# EAGLE design Controller (EAGLE 9.1.1)
AUTOR: Alexander Miller; PROJECT: HeRo Mini

## Sheet 1 of 2
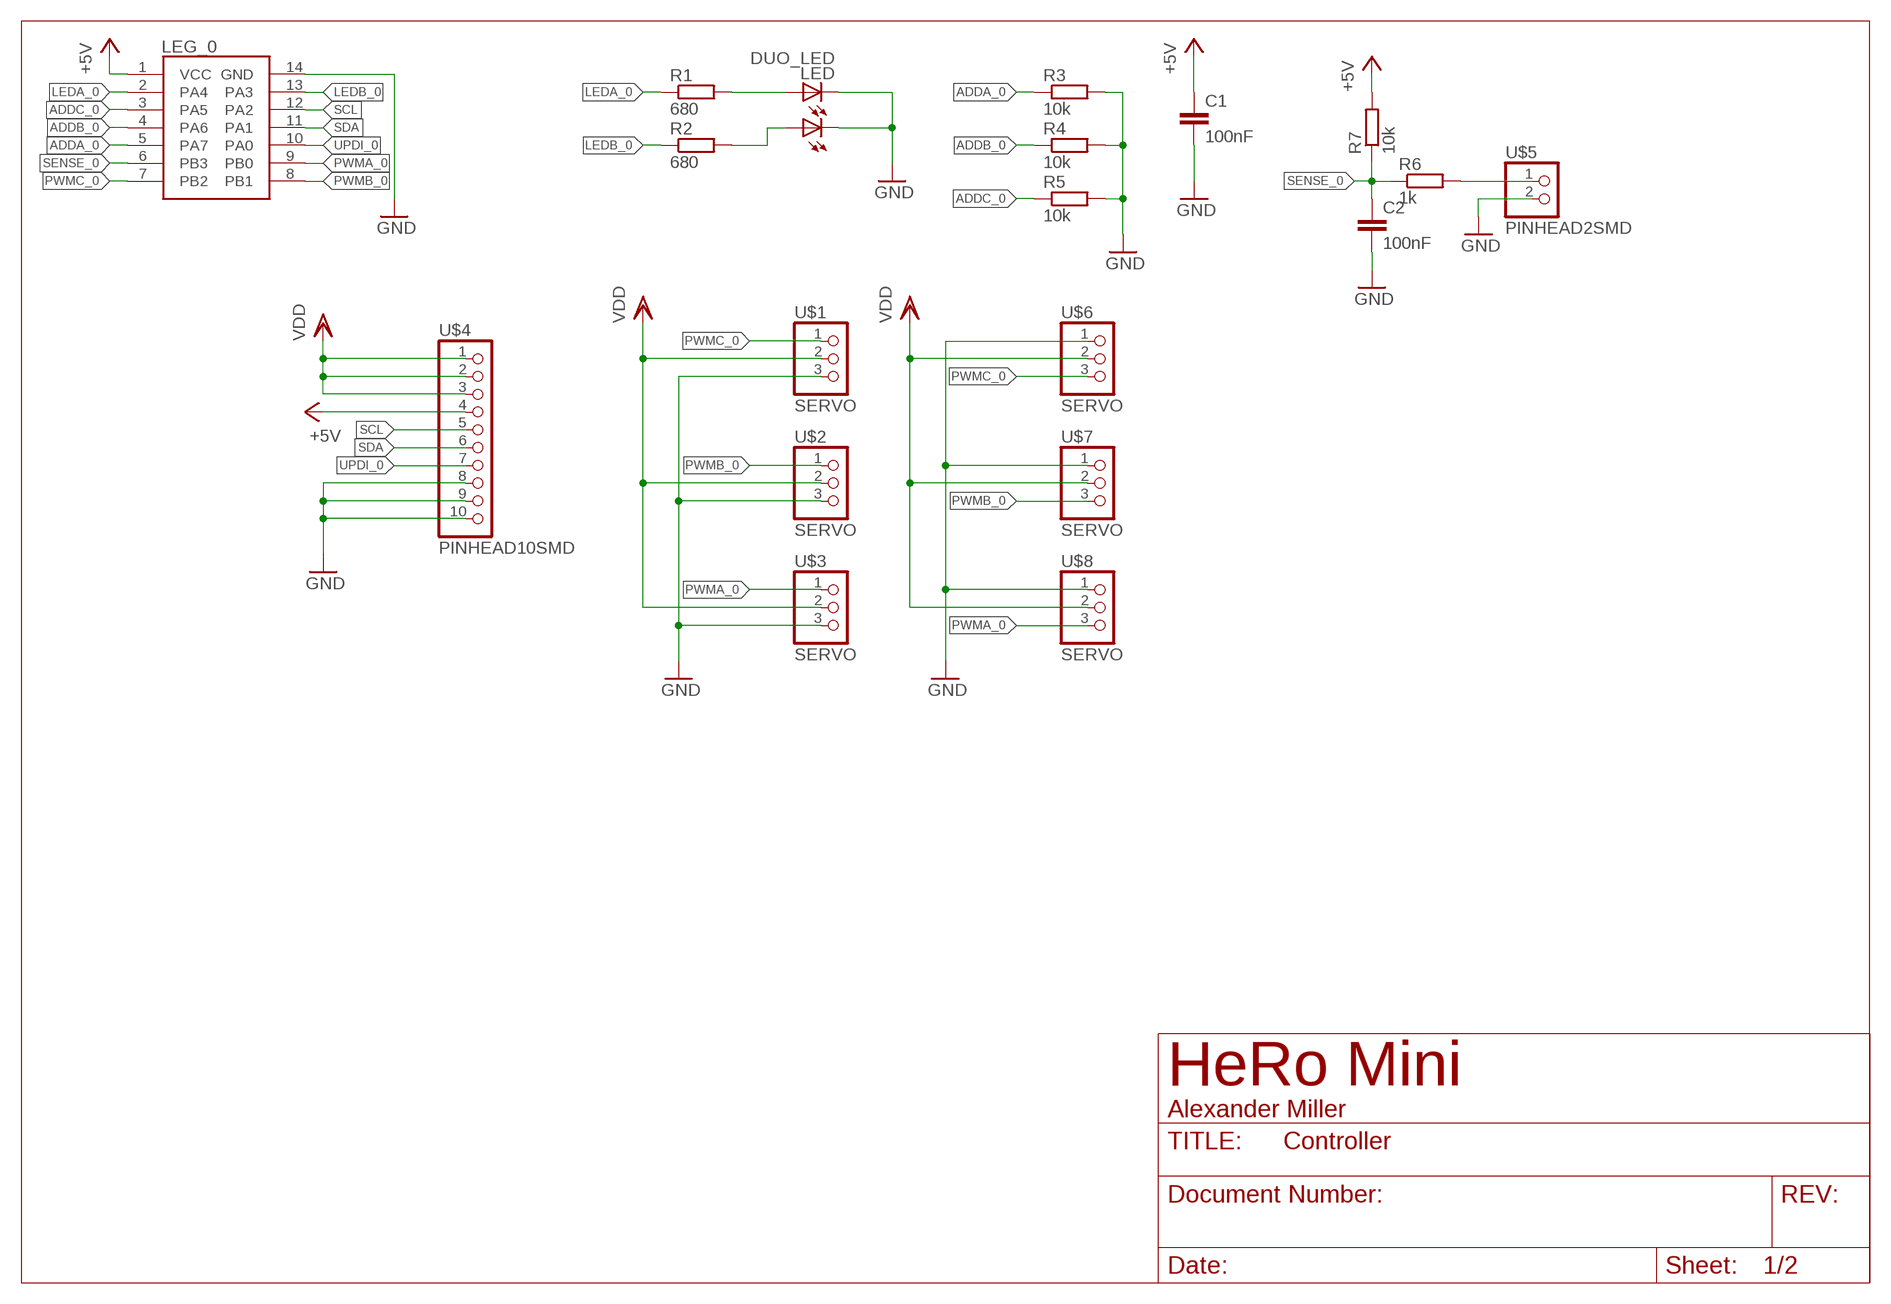
[diagram p0: schematic, sheet 1]

### Parts
C1  100nF  C-EUC0805  [C0805]
C2  100nF  C-EUC0805  [C0805]
LED  DUO_LED  [DUO_LED]
LEG_0  ATTINY16142  [SOIC127P600X175-14]
R1  680  R-EU_R0805  [R0805]
R2  680  R-EU_R0805  [R0805]
R3  10k  R-EU_R0805  [R0805]
R4  10k  R-EU_R0805  [R0805]
R5  10k  R-EU_R0805  [R0805]
R6  1k  R-EU_R0805  [R0805]
R7  10k  R-EU_R0805  [R0805]
U$1  SERVO  [SL12SMD058]
U$2  SERVO  [SL12SMD058]
U$3  SERVO  [SL12SMD058]
U$4  PINHEAD10SMD  [PINHD10SMD]
U$5  PINHEAD2SMD  [PINHD2SMD]
U$6  SERVO  [SL12SMD058]
U$7  SERVO  [SL12SMD058]
U$8  SERVO  [SL12SMD058]

### Nets
+5V: C1.1 LEG_0.1(VCC) R7.2 U$4.4
ADDA_0: LEG_0.5(PA7) R3.1
ADDB_0: LEG_0.4(PA6) R4.1
ADDC_0: LEG_0.3(PA5) R5.1
GND: C1.2 C2.2 LED.CG LED.CR LEG_0.14(GND) R3.2 R4.2 R5.2 U$1.3 U$2.3 U$3.3 U$4.8 U$4.9 U$4.10 U$5.2 U$6.1 U$7.1 U$8.1
LEDA_0: LEG_0.2(PA4) R1.1
LEDB_0: LEG_0.13(PA3) R2.1
N$1: LED.AG R1.2
N$2: LED.AR R2.2
N$4: R6.2 U$5.1
PWMA_0: LEG_0.9(PB0) U$3.1 U$8.3
PWMB_0: LEG_0.8(PB1) U$2.1 U$7.3
PWMC_0: LEG_0.7(PB2) U$1.1 U$6.3
SCL: LEG_0.12(PA2) U$4.5
SDA: LEG_0.11(PA1) U$4.6
SENSE_0: C2.1 LEG_0.6(PB3) R6.1 R7.1
UPDI_0: LEG_0.10(PA0) U$4.7
VDD: U$1.2 U$2.2 U$3.2 U$4.1 U$4.2 U$4.3 U$6.2 U$7.2 U$8.2

## Sheet 2 of 2
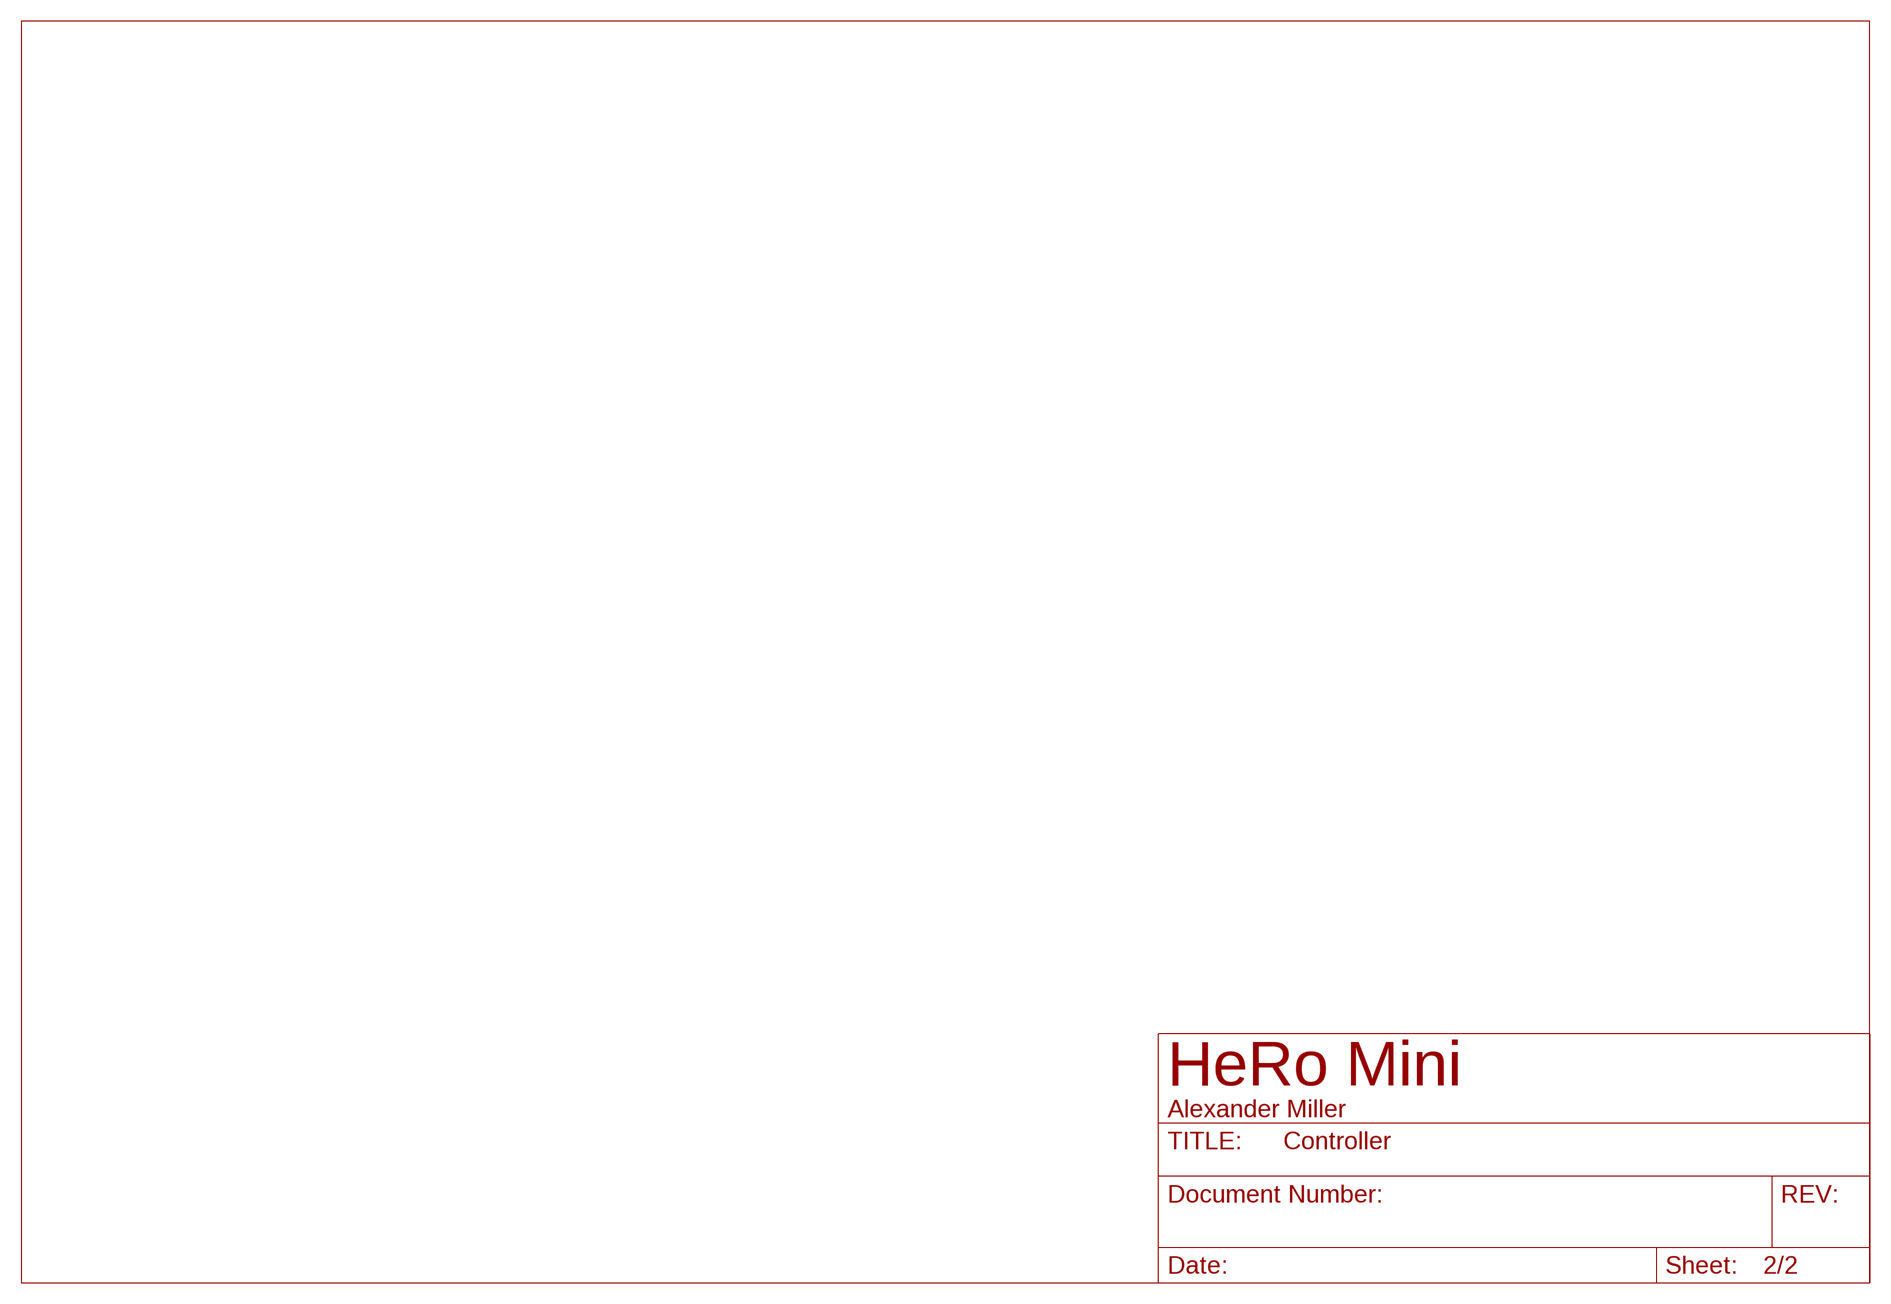
[diagram p1: schematic, sheet 2]

## Library data of the parts
C1 C2 = rcl:C-EU: CAPACITOR, European symbol; SPICEPREFIX: C
LED = HeRo:DUO_LED
LEG_0 = HeRo:ATTINY1614; SPICEPREFIX: X
R1-R7 = rcl:R-EU_: RESISTOR, European symbol; SPICEPREFIX: R
U$1-U$3 U$6-U$8 = HeRo:SERVO
U$4 = HeRo:PINHEAD10SMD
U$5 = HeRo:PINHEAD2SMD

## Board
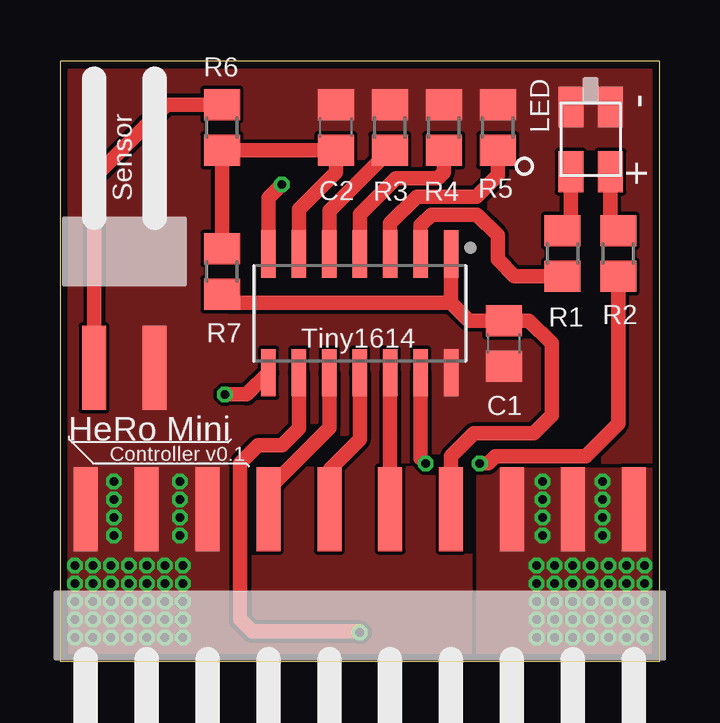
[diagram p2: board, top side]
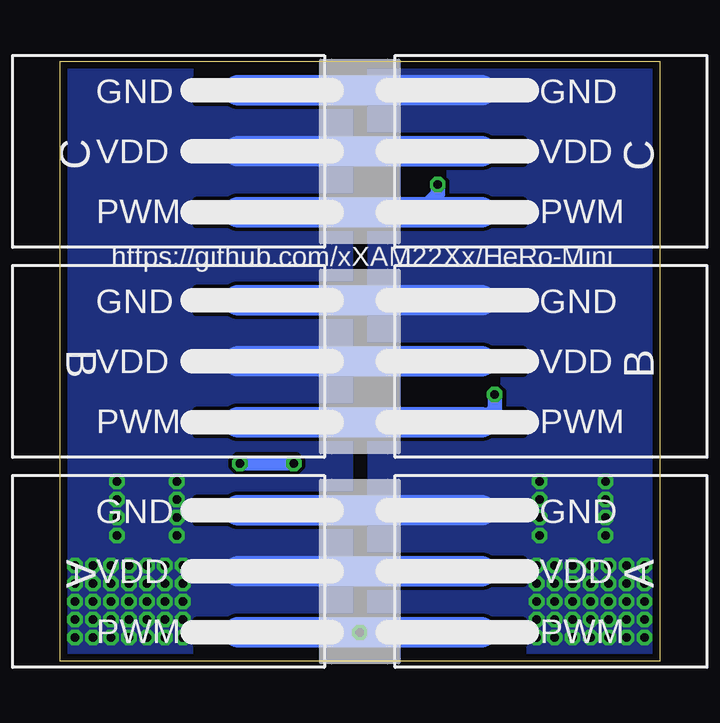
[diagram p3: board, bottom side, seen from below]

Size 25 x 25 mm. Coordinates in mm from the lower left corner, seen from the top.
Outline: 0,0 25,0 25,25 0,25 0,0
Copper layers (1*16): Top 0.035mm / dielectric 1.5mm / Bottom 0.035mm
Design rules "PCB-POOL Standard *": minimum track width 0.15mm, minimum drill 0.3mm, track to track 0.15mm, track to pad 0.15mm, pad to pad 0.15mm, via to via 0.15mm, smd to smd 0.15mm, copper to edge 0.3mm, drill to drill 0.2mm, minimum pad ring 0.2mm, minimum via ring 0.15mm, stop-mask expansion 0.075mm, vias tented up to drill 0mil, thermal gap 0.2mm

### Footprints (pad centres in the part's own frame; a part is rotated, then mirrored left to right if it is on the bottom)
C0805 = smd 1.3 x 1.5: 1 -0.95,0; 2 0.95,0
DUO_LED = smd 1.7 x 1.05: AG 1.35,-0.825; AR 1.35,0.825; CG -1.35,-0.825; CR -1.35,0.825
SOIC127P600X175-14 = smd 1.968 x 0.602: 1 -2.473,3.81; 2 -2.473,2.54; 3 -2.473,1.27; 4 -2.473,0; 5 -2.473,-1.27; 6 -2.473,-2.54; 7 -2.473,-3.81; 8 2.473,-3.81; 9 2.473,-2.54; 10 2.473,-1.27; 11 2.473,0; 12 2.473,1.27; 13 2.473,2.54; 14 2.473,3.81
R0805 = smd 1.3 x 1.5: 1 -0.95,0; 2 0.95,0
SL12SMD058 = smd 3.5 x 1: 1 -5.08,2.54; 2 -5.08,0; 3 -5.08,-2.54
PINHD10SMD = smd 3.5 x 1: 1 -5.08,11.43; 2 -5.08,8.89; 3 -5.08,6.35; 4 -5.08,3.81; 5 -5.08,1.27; 6 -5.08,-1.27; 7 -5.08,-3.81; 8 -5.08,-6.35; 9 -5.08,-8.89; 10 -5.08,-11.43
PINHD2SMD = smd 3.5 x 1: 1 -5.08,1.27; 2 -5.08,-1.27

### Placement (x,y rotation side)
C1  18.5,13.25 270 top
C2  11.5,22.25 90 top
LED  22.12,21.75 270 top
LEG_0  12.5,14.5 270 top
R1  20.95,17 90 top
R2  23.28,17 90 top
R3  13.75,22.25 90 top
R4  16,22.25 90 top
R5  18.25,22.25 90 top
R6  6.75,22.25 90 top
R7  6.75,16.25 270 top
U$1  12.5,21.25 180 bottom
U$2  12.5,12.5 180 bottom
U$3  12.5,3.75 180 bottom
U$4  12.5,1.27 270 top
U$5  2.69,17.31 90 top
U$6  12.5,21.25 0 bottom
U$7  12.5,12.5 0 bottom
U$8  12.5,3.75 0 bottom

### Tracks (layer width: path | path; a pad name or v marks a point on that pad's centre or on a via)
+5V
  Top 0.61: U$4.4 16.31,8.56 17.25,9.5 19.75,9.5 20.5,10.25 20.5,13.25 19.55,14.2 C1.1 17.05,14.2 16.31,14.94 | 16.31,14.94 LEG_0.1 | R7.2 7.11,14.94 16.31,14.94
ADDA_0
  Top 0.61: R3.1 11.23,18.78 LEG_0.5
ADDB_0
  Top 0.61: R4.1 16,20.38 15.75,20.12 14,20.12 12.5,18.62 LEG_0.4
ADDC_0
  Top 0.61: R5.1 18.25,20.25 17.36,19.36 14.88,19.36 13.77,18.26 LEG_0.3
GND  (via drill 0.35)
  Bottom 1.27: U$8.1 U$3.3 | U$2.3 U$7.1 | U$1.3 U$6.1
  other vias: 2.25,7.5 2.25,6.75 2.25,6 2.25,5.25 5,7.5 5,6.75 5,6 5,5.25 0.62,4 0.62,3.25 0.62,2.5 0.62,1.75 0.62,1 1.38,4 1.38,3.25 1.38,2.5 1.38,1.75 1.38,1 2.12,4 2.12,3.25 2.12,2.5 2.12,1.75 2.12,1 2.88,4 2.88,3.25 2.88,2.5 2.88,1.75 2.88,1 3.62,4 3.62,3.25 3.62,2.5 3.62,1.75 3.62,1 4.38,4 4.38,3.25 4.38,2.5 4.38,1.75 4.38,1 5.12,4 5.12,3.25 5.12,2.5 5.12,1.75 5.12,1
  pour Bottom (rank 6, no thermals): 0,25 12,25 12,0 0,0
  pour Top (rank 6, no thermals): 0,25 25,25 25,0 0,0
  pour Top (no thermals): 0,7.89 7.43,7.89 7.43,0 0,0
LEDA_0
  Top 0.61: R1.1 18.95,16.05 18.25,16.75 18.25,17.75 17.39,18.61 15.48,18.61 15.04,18.16 LEG_0.2
LEDB_0  (via drill 0.35)
  Top 0.61: LEG_0.13 15.04,8.46 v15.25,8.25 | v17.5,8.25 17.86,8.25 18.16,8.55 21.93,8.55 23.28,9.9 R2.1
  Bottom 0.61: v15.25,8.25 v17.5,8.25
N$1
  Top 0.61: R1.2 21.3,18.3 LED.AG
N$2
  Top 0.61: R2.2 22.95,18.27 LED.AR
N$4
  Top 0.61: R6.2 4.45,23.2 1.42,20.17 U$5.1
PWMA_0  (via drill 0.35)
  Top 0.61: LEG_0.9 9.96,9.71 9.25,9 8.25,9 7.5,8.25 7.5,1.75 8,1.25 12.46,1.25 v12.5,1.21
  Bottom 1.27: U$3.1 v12.5,1.21 U$8.3
PWMB_0  (via drill 0.35)
  Top 0.61: LEG_0.8 7.79,11.12 v6.88,11.12
  Bottom 0.61: v6.88,11.12 6.88,10.51 U$2.1
  Bottom 1.27: U$2.1 U$7.3
PWMC_0  (via drill 0.35)
  Top 0.61: LEG_0.7 8.69,19.32 v9.25,19.88
  Bottom 0.61: v9.25,19.88 9.25,19.46 10,18.71
  Bottom 1.27: U$1.1 10,18.71 U$6.3
SCL
  Top 0.61: LEG_0.12 U$4.5
SDA
  Top 0.61: LEG_0.11 12.5,9.25 11.25,8 11.25,6.37 U$4.6
SENSE_0
  Top 0.61: R7.1 R6.1 C2.1 11.5,20.38 9.96,18.84 LEG_0.6
UPDI_0
  Top 0.61: LEG_0.10 11.23,9.73 8.69,7.19 U$4.7
VDD  (via drill 0.35)
  Bottom 1.27: U$3.2 U$8.2 | U$7.2 U$2.2 | U$6.2 12,21.25 U$1.2
  other vias: 20.12,7.5 20.12,6.75 20.12,6 20.12,5.25 22.62,7.5 22.62,6.75 22.62,6 22.62,5.25 19.88,4 19.88,3.25 19.88,2.5 19.88,1.75 19.88,1 20.62,4 20.62,3.25 20.62,2.5 20.62,1.75 20.62,1 21.38,4 21.38,3.25 21.38,2.5 21.38,1.75 21.38,1 22.12,4 22.12,3.25 22.12,2.5 22.12,1.75 22.12,1 22.88,4 22.88,3.25 22.88,2.5 22.88,1.75 22.88,1 23.62,4 23.62,3.25 23.62,2.5 23.62,1.75 23.62,1 24.38,4 24.38,3.25 24.38,2.5 24.38,1.75 24.38,1
  pour Top (no thermals): 17.57,7.89 25,7.89 25,0 17.57,0
  pour Bottom (no thermals): 13,25 13,0 25,0 25,25

### Text on the board
tNames: Sensor | Tiny1614 | HeRo Mini | Controller v0.1
bNames: GND | GND | C | VDD | VDD | C | PWM | PWM | https://github.com/xXAM22Xx/HeRo-Mini | GND | GND | B | B | VDD | VDD | PWM | PWM | GND | GND | A | A | VDD | VDD | PWM | PWM